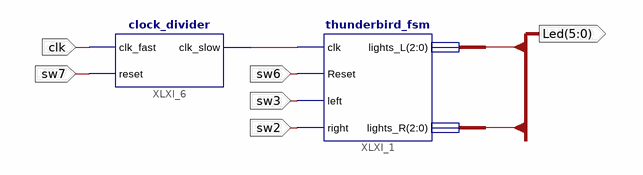
[diagram p0: schematic sheet 1]
// Xilinx ISE schematic orner_top.sch (spartan3e) as structural Verilog: 2 symbols, 6 ports
module orner_top (
  input  sw6,
  input  sw3,
  input  sw2,
  input  sw7,
  input  clk,
  output [5:0] Led
);

  wire XLXN_11;

  thunderbird_fsm XLXI_1 (
    .clk(XLXN_11), .Reset(sw6), .left(sw3), .right(sw2), .lights_L(Led[5:3]),
    .lights_R({Led[0], Led[1], Led[2]}));
  clock_divider XLXI_6 (.clk_fast(clk), .reset(sw7), .clk_slow(XLXN_11));
endmodule
